# Altium schematic sheet pca20020_sheet8_power_supply.SchDoc: PCA20020 - Power Supply
size A4; DocumentNumber: 8; Revision: 1.0.0; SheetNumber: 8; SheetTotal: 9; DrawnBy: RUBR; PCBRevision: 0264RUBR; DocumentSize: A4; PCAName: PCA20020; PCBNumber: 400182
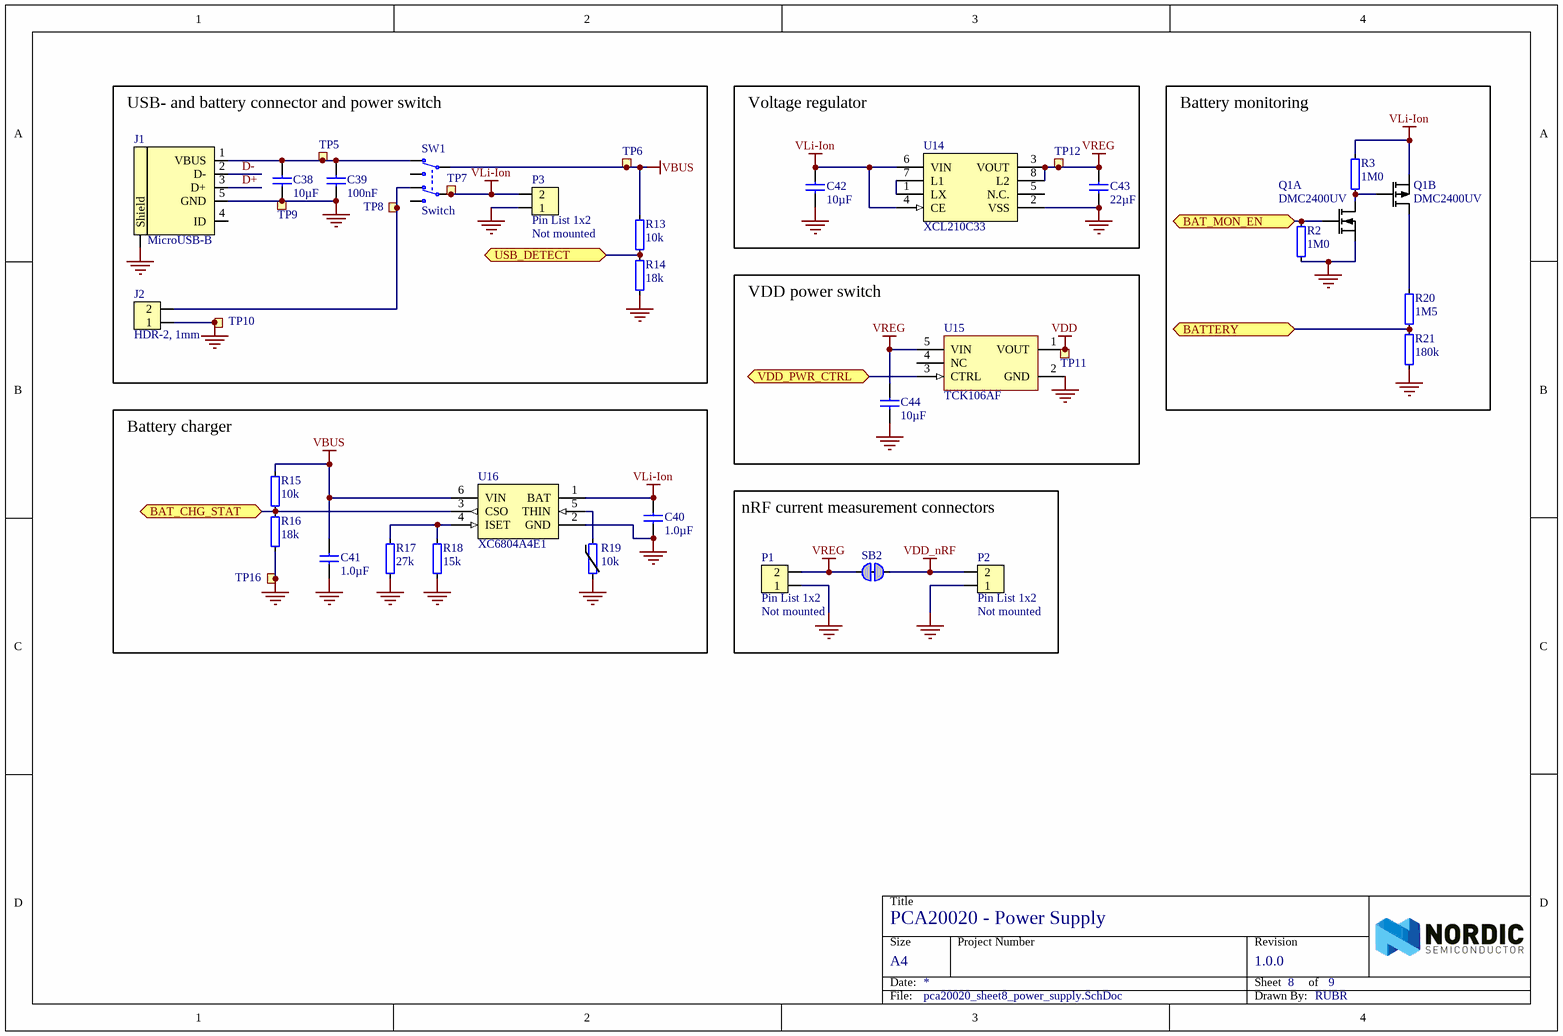
[diagram p0: pca20020_sheet8_power_supply.SchDoc]

## Parts
C38  10µF  [CAPC1608X06L]
C39  100nF  [CAPC1005X04L]
C40  1.0µF  [CAPC1608X06L]
C41  1.0µF  [CAPC1608X06L]
C42  10µF  [CAPC1608X06L]
C43  22µF  [CAPC1608X06L]
C44  10µF  [CAPC1608X06L]
J1  MicroUSB-B  [USB-Micro-B-RA-SMD-PiP]
J2  HDR-2, 1mm  [SM02B-SRSS-TB]
P1  Pin List 1x2  Assembly: Not mounted  [LIST_1x2-NC]
P2  Pin List 1x2  Assembly: Not mounted  [LIST_1x2-NC]
P3  Pin List 1x2  Assembly: Not mounted  [LIST_1x2-NC]
Q1  DMC2400UV  [SOTFL50P162X60-6N]  (parts A,B of 2)
R2  1M0  [RESC1005X04L]
R3  1M0  [RESC1005X04L]
R13  10k  [RESC1005X04L]
R14  18k  [RESC1005X04L]
R15  10k  [RESC1005X04L]
R16  18k  [RESC1005X04L]
R17  27k  [RESC1005X04L]
R18  15k  [RESC1005X04L]
R19  10k  [RESC1005X04L]
R20  1M5  [RESC1005X04L]
R21  180k  [RESC1005X04L]
SB2  Solderbridge  [Solderbridge_Shorted]  (value not drawn)  (net tie, no BOM)
SW1  Switch  [Switch-Slide-RA-J-Lead-DPDT-8.5x3.5mm]
TP5  Ø1.5mm,SMD  [TP_SMD_Ø1.5mm]  (value not drawn)  (no BOM)
TP6  Ø1.5mm,SMD  [TP_SMD_Ø1.5mm]  (value not drawn)  (no BOM)
TP7  Ø1.5mm,SMD  [TP_SMD_Ø1.5mm]  (value not drawn)  (no BOM)
TP8  Ø1.5mm,SMD  [TP_SMD_Ø1.5mm]  (value not drawn)  (no BOM)
TP9  Ø1.5mm,SMD  [TP_SMD_Ø1.5mm]  (value not drawn)  (no BOM)
TP10  Ø1.5mm,SMD  [TP_SMD_Ø1.5mm]  (value not drawn)  (no BOM)
TP11  Ø1.5mm,SMD  [TP_SMD_Ø1.5mm]  (value not drawn)  (no BOM)
TP12  Ø1.5mm,SMD  [TP_SMD_Ø1.5mm]  (value not drawn)  (no BOM)
TP16  TP  [TESTPAD-TH]  (value not drawn)  (no BOM)
U14  XCL210C33  [CL-2025]
U15  TCK106AF  [SOT95P280X140-5N]
U16  XC6804A4E1  [USP-6EL]

## Blocks framed on the sheet
USB- and battery connector and power switch: C38 C39 J1 J2 P3 R13 R14 SW1 TP5-TP10
Voltage regulator: C42 C43 TP12 U14
Battery monitoring: Q1 R2 R3 R20 R21
VDD power switch: C44 TP11 U15
Battery charger: C40 C41 R15-R19 TP16 U16
nRF current measurement connectors: P1 P2 SB2

## Ports
BAT_CHG_STAT (bidir), BAT_MON_EN (bidir), BATTERY (bidir), USB_DETECT (bidir), VDD_PWR_CTRL (bidir)

## Nets
GND: C38.2 C39.2 C40.1 C41.1 C42.1 C43.1 C44.1 J1.5(GND) J1.6(Shield) J2.1 P1.1 P2.1 P3.1 Q1.1(S1) R2.2 R14.2 R16.2 R17.2 R18.2 R19.2 R21.2 TP9.1 TP10.1 TP16.1 U14.2(VSS) U14.9(VSS) U15.2(GND) U16.2(GND) U16.7(GND)
VBUS: C41.2 R13.1 R15.1 SW1.2(COM-1) TP6.1 U16.6(VIN)
VDD: TP11.1 U15.1(VOUT)
VDD_nRF: P2.2 SB2.1
VLi-Ion: C40.2 C42.2 P3.2 Q1.4(S2) R3.1 SW1.5(COM-2) TP7.1 U14.4(CE) U14.6(VIN) U16.1(BAT)
VREG: C43.2 C44.2 P1.2 SB2.2 TP12.1 U14.3(VOUT) U14.8(L2) U15.5(VIN)
BAT_CHG_STAT: R15.2 R16.1 U16.3(CSO) ; port BAT_CHG_STAT
BAT_MON_EN: Q1.2(G1) R2.1 ; port BAT_MON_EN
BATTERY: R20.2 R21.1 ; port BATTERY
D+: J1.3(D+)
D-: J1.2(D-)
USB_DETECT: R13.2 R14.1 ; port USB_DETECT
VDD_PWR_CTRL: U15.3(CTRL) ; port VDD_PWR_CTRL
NetC38_1: C38.1 C39.1 J1.1(VBUS) SW1.3(N.C-1) TP5.1
NetJ2_2: J2.2 SW1.6(N.C-2) TP8.1
NetQ1_3: Q1.3(D2) R20.1
NetQ1_5: Q1.5(G2) Q1.6(D1) R3.2
NetR17_1: R17.1 R18.1 U16.4(ISET)
NetR19_1: R19.1 U16.5(THIN)
NetU14_1: U14.1(LX) U14.7(L1)

Not connected (* = marked no-connect by the designer): J1 4(ID); SW1 1(N.O-1) 4(N.O-2); U14 5(N.C.); U15 4(NC)

## Notes on the sheet
- Title
- Size
- Date:
- Project Number
- Sheet         of
- Revision
- File:
- Drawn By:

## Library data of the parts
C38 C42 C44 = C0603-10µ: Capacitor, X5R, ±20%; Part number IPS: 00000007785; Note: 6.3V; Artikkelnr Noca: 20039234; Artikkelnr Simpro: N.A.; Part Number: C0603-10µ; Manufacturer: *; Manufacturer Part Number: *; Datasheet: *; LatestRevisionDate: 2011-01-17; Pin Count: 2; Publisher: Nordic Semiconductor; Published: 2011-01-17; Value: 10µF; Supplier: *; Supplier part number: *; 2nd source Supplier: *; 2nd source part number: *; Footprint Doc: 0603
C39 = C0402-100n: Capacitor, X7R, ±10%; Part number IPS: 00000005296; Note: 16V; Artikkelnr Noca: 20039200; Artikkelnr Simpro: N.A.; Part Number: C0402-100n; Manufacturer: *; Manufacturer Part Number: *; Datasheet: *; LatestRevisionDate: 2009-11-23; Pin Count: 2; Publisher: Nordic Semiconductor; Published: 2009-05-08; Value: 100nF; Supplier: *; Supplier part number: *; 2nd source Supplier: *; 2nd source part number: *; Footprint Doc: 0402
C40 C41 = C0603-1µ0: Capacitor, X7R, ±10%; Part number IPS: 00000000616; Note: 16V; Artikkelnr Noca: 20039335; Artikkelnr Simpro: N.A.; Part Number: C0603-1µ0; Manufacturer: *; Manufacturer Part Number: *; Datasheet: *; Footprint Doc: 0603; LatestRevisionDate: 2013-06-05; Pin Count: 2; Publisher: Nordic Semiconductor; Published: 2009-05-08; Value: 1.0µF; Supplier: *; Supplier part number: *; 2nd source Supplier: *; 2nd source part number: *
C43 = C0603-22µ-6.3V: CAP CER 22UF 6.3V 20% X5R 0603; Manufacturer: Samsung; Manufacturer Part Number: CL10A226MQ8NRNC; Part number IPS: 00000007787; Artikkelnr Noca: N.A.; Part Number: C0603-22µ-6.3V; Datasheet: http://www.samsungsem.com/kr/front/downloadcms.do?path=/kr/support/product-search/mlcc/__icsFiles/afieldfile/2014/11/05&fileName=S_CL10A226MQ8NRNC.pdf; Footprint Doc: 0603; LatestRevisionDate: 2015-04-10; Pin Count: 2; Publisher: Nordic Semiconductor; Published: 2015-04-10; Value: 22µF; Note: 6.3V; Supplier: Digi-Key; Supplier part number: 1276-1193-1-ND; 2nd source Supplier: *; 2nd source part number: *; Artikkelnr Simpro: N.A.
J1 = USB-Micro-B-RA-SMD-PiP: MicroUSB-B-SMT; Manufacturer: Allen Creations Corp.; Manufacturer Part Number: AJU55-BS2111-L; 2nd source part number: 609-4616-1-ND; Part number IPS: 00000007790; Artikkelnr Noca: 55029020; Artikkelnr Simpro: N.A.; Part Number: USB-Micro-B-RA-SMD-PiP; Datasheet: \\hizz\pro\app9717\Datasheet\connectores\Allen Creations Corp\AJU-211.pdf; Footprint Doc: USB-Micro-B-RA-SMD-PiP; LatestRevisionDate: 2016-04-21; Pin Count: 5; Publisher: Nordic Semiconductor; Published: 2014-10-07; Value: MicroUSB-B; Note: *; Supplier: Cabcon; Supplier part number: AJU55-BS2111-L; 2nd source Supplier: Digi-Key
J2 = SM02B-SRSS-TB: 1.0mm pitch connector side entry SMD; Manufacturer: JST; Manufacturer Part Number: SM02B-SRSS-TB(LF)(SN); Part number IPS: 00000007791; Note: JST, Header; Artikkelnr Noca: 55010030; Artikkelnr Simpro: N.A.; Part Number: SM02B-SRSS-TB; Datasheet: http://www.jst-mfg.com/product/pdf/eng/eSH.pdf; Footprint Doc: SM02B-SRSS-TB; LatestRevisionDate: 2016-06-20; Pin Count: 2; Publisher: Nordic Semiconductor; Published: 2016-06-20; Value: HDR-2, 1mm; Supplier: Digi-Key; Supplier part number: 455-1802-1-ND; 2nd source Supplier: *; 2nd source part number: *
P1-P3 = Pin List 1x2, N.C.: Pin List 1x2, 2.54mm (100mil); Artikkelnr Noca: N.A.; Part Number: Pin List 1x2, N.C.; Manufacturer: *; Manufacturer Part Number: *; Datasheet: *; Footprint Doc: LIST_1x2; LatestRevisionDate: 2017-02-02; Pin Count: 2; Publisher: Nordic Semiconductor; Published: 2017-01-30; Value: Pin List 1x2; Note: *; Supplier: *; Supplier part number: *; 2nd source Supplier: *; 2nd source part number: *; Artikkelnr Simpro: N.A.
Q1 = DMC2400UV: Dual N & P Ch MOFET, 1.03A/0.7A, 480mOhm, 450mW; Manufacturer: Diodes Incorporated; Part number IPS: 00000007803; Note: Dual N & P Channel Digital FET; Artikkelnr Noca: N.A.; Part Number: DMC2400UV; Manufacturer Part Number: DMC2400UV; Datasheet: http://www.diodes.com/_files/datasheets/DMC2400UV.pdf; Footprint Doc: SOT-563; LatestRevisionDate: 2016-01-18; Pin Count: 6; Publisher: Nordic Semiconductor; Published: 2016-01-18; Value: DMC2400UV; Supplier: Digi-Key; Supplier part number: DMC2400UV-7DICT-ND; 2nd source Supplier: *; 2nd source part number: *; Artikkelnr Simpro: N.A.
R2 R3 = R0402-1M0: Resistor, ±1%, 0.063W; Part number IPS: 00000006807; Note: Chip Res 1%; Artikkelnr Noca: 27049145; Artikkelnr Simpro: N.A.; Value Ohm: 1000000; Part Number: R0402-1M0; Manufacturer: *; Manufacturer Part Number: *; Datasheet: *; LatestRevisionDate: 2009-11-23; Pin Count: 2; Publisher: Nordic Semiconductor; Published: 2009-05-08; Value: 1M0; Supplier: *; Supplier part number: *; 2nd source Supplier: *; 2nd source part number: *; Footprint Doc: 0402
R13 R15 = R0402-10k: Resistor, ±1%, 0.063W; Part number IPS: 00000002093; Note: Chip Res 1%; Artikkelnr Noca: 27049097; Artikkelnr Simpro: N.A.; Value Ohm: 10000; Part Number: R0402-10k; Manufacturer: *; Manufacturer Part Number: *; Datasheet: *; LatestRevisionDate: 2009-11-23; Pin Count: 2; Publisher: Nordic Semiconductor; Published: 2009-05-08; Value: 10k; Supplier: Farnell; Supplier part number: 173-8864; 2nd source Supplier: *; 2nd source part number: *; Footprint Doc: 0402
R14 R16 = R0402-18k: Resistor, ±1%, 0.063W; Part number IPS: 00000003300; Note: Chip Res 1%; Artikkelnr Noca: 27049103; Artikkelnr Simpro: N.A.; Value Ohm: 18000; Part Number: R0402-18k; Manufacturer: *; Manufacturer Part Number: *; Datasheet: *; LatestRevisionDate: 2009-11-23; Pin Count: 2; Publisher: Nordic Semiconductor; Published: 2009-05-08; Value: 18k; Supplier: Farnell; Supplier part number: 173-8867; 2nd source Supplier: *; 2nd source part number: *; Footprint Doc: 0402
R17 = R0402-27k: Resistor, ±1%, 0.063W; Part number IPS: 00000004188; Note: Chip Res 1%; Artikkelnr Noca: 27049107; Artikkelnr Simpro: N.A.; Value Ohm: 27000; Part Number: R0402-27k; Manufacturer: *; Manufacturer Part Number: *; Datasheet: *; LatestRevisionDate: 2009-11-23; Pin Count: 2; Publisher: Nordic Semiconductor; Published: 2009-05-08; Value: 27k; Supplier: Farnell; Supplier part number: 173-8869; 2nd source Supplier: *; 2nd source part number: *; Footprint Doc: 0402
R18 = R0402-15k: Resistor, ±1%, 0.063W; Part number IPS: 00000002098; Note: Chip Res 1%; Artikkelnr Noca: 27049101; Artikkelnr Simpro: N.A.; Value Ohm: 15000; Part Number: R0402-15k; Manufacturer: *; Manufacturer Part Number: *; Datasheet: *; LatestRevisionDate: 2009-11-23; Pin Count: 2; Publisher: Nordic Semiconductor; Published: 2009-05-08; Value: 15k; Supplier: Farnell; Supplier part number: 173-8866; 2nd source Supplier: *; 2nd source part number: *; Footprint Doc: 0402
R19 = NCP15XH103F03RC: THERMISTOR 10K OHM NTC 0402 SMD; Manufacturer: Murata; 2nd source part number: 2456121; Part number IPS: 00000007808; Note: Chip Res 1%; Artikkelnr Noca: N.A.; Value Ohm: 10000; Part Number: NCP15XH103F03RC; Manufacturer Part Number: NCP15XH103F03RC; Datasheet: *; LatestRevisionDate: 2015-03-25; Pin Count: 2; Publisher: Nordic Semiconductor; Published: 2015-03-25; Value: 10k; Supplier: Digi-Key; Supplier part number: 490-4801-1-ND; 2nd source Supplier: Farnell; Footprint Doc: 0402; Artikkelnr Simpro: N.A.
R20 = R0402-1M5: Resistor, ±1%, 0.063W; Part number IPS: 00000007809; Note: Chip Res 1%; Artikkelnr Noca: 27049149; Artikkelnr Simpro: N.A.; Value Ohm: 1500000; Part Number: R0402-1M5; Manufacturer: *; Manufacturer Part Number: *; Datasheet: *; LatestRevisionDate: 2009-11-23; Pin Count: 2; Publisher: Nordic Semiconductor; Published: 2009-05-08; Value: 1M5; Supplier: *; Supplier part number: *; 2nd source Supplier: *; 2nd source part number: *; Footprint Doc: 0402
R21 = R0402-180k: Resistor, ±1%, 0.063W; Part number IPS: 00000007810; Note: Chip Res 1%; Artikkelnr Noca: 27049127; Artikkelnr Simpro: N.A.; Value Ohm: 180000; Part Number: R0402-180k; Manufacturer: *; Manufacturer Part Number: *; Datasheet: *; LatestRevisionDate: 2009-11-23; Pin Count: 2; Publisher: Nordic Semiconductor; Published: 2009-05-08; Value: 180k; Supplier: *; Supplier part number: *; 2nd source Supplier: *; 2nd source part number: *; Footprint Doc: 0402
SB2 = Solderbridge Shorted: Shorted Solderbridge; Artikkelnr Noca: N.A.; Part Number: Solderbridge Shorted; Manufacturer: *; Manufacturer Part Number: *; Datasheet: *; Footprint Doc: Solderbridge_Shorted; LatestRevisionDate: 2012-08-07; Pin Count: 2; Publisher: Nordic Semiconductor; Published: 2012-08-07; Value: Solderbridge; Note: *; Supplier: *; Supplier part number: *; 2nd source Supplier: *; 2nd source part number: *; Artikkelnr Simpro: N.A.
SW1 = Switch-Slide-RA-J-Lead-DPDT-8.5x3.5mm_C&K: SMD slide Switch (ON-ON); Manufacturer: C&K Components; Manufacturer Part Number: JS202011JAQN; 2nd source part number: 611-JS202011JAQN; Part number IPS: 00000007811; Artikkelnr Noca: N.A.; Part Number: Switch-Slide-RA-J-Lead-DPDT-8.5x3.5mm_C&K; Datasheet: http://www.ck-components.com/media/1422/js.pdf; Footprint Doc: Switch-Slide-RA-J-Lead-DPDT-8.5x3.5mm; LatestRevisionDate: 2017-02-01; Pin Count: 6; Publisher: Nordic Semiconductor; Published: 2016-09-15; Value: Switch; Note: *; Supplier: Digi-Key; Supplier part number: CKN10722CT-ND; 2nd source Supplier: Mouser; Artikkelnr Simpro: N.A.
TP5-TP12 = TP_SMD_Ø1.5MM: 1.0mm circular SMD testpad; Manufacturer: Nordic Semiconductor; Artikkelnr Noca: N.A.; Part Number: TP_SMD_Ø1.5MM; Manufacturer Part Number: *; Datasheet: *; Footprint Doc: TP_SMD_Ø1.5mm; LatestRevisionDate: 2016-06-02; Pin Count: 1; Publisher: Nordic Semiconductor; Published: 2016-06-02; Value: Ø1.5mm,SMD; Note: *; Supplier: *; Supplier part number: *; 2nd source Supplier: *; 2nd source part number: *; Artikkelnr Simpro: N.A.
TP16 = Testpoint TH: Testpoint, through hole; Artikkelnr Noca: N.A.; Part Number: Testpoint TH; Manufacturer: *; Manufacturer Part Number: *; Datasheet: *; Footprint Doc: TESTPAD-TH; LatestRevisionDate: 2009-12-12; Pin Count: 1; Publisher: Nordic Semiconductor; Published: 2009-12-12; Value: TP; Note: *; Supplier: *; Supplier part number: *; 2nd source Supplier: *; 2nd source part number: *; Artikkelnr Simpro: N.A.
U14 = XCL210C33: 3.3V 200mA Inductor Built-in Step-Down “micro DC/DC” Converter; Manufacturer: Torex Semiconductor; Part number IPS: 00000007826; Artikkelnr Noca: N.A.; Part Number: XCL210C33; Manufacturer Part Number: XCL210C33; Datasheet: https://www.torexsemi.com/file/xcl210/XCL210.pdf; Footprint Doc: CL-2025; LatestRevisionDate: 2017-01-30; Pin Count: 8; Publisher: Nordic Semiconductor; Published: 2016-09-29; Value: XCL210C33; Note: *; Supplier: *; Supplier part number: *; 2nd source Supplier: *; 2nd source part number: *; Artikkelnr Simpro: N.A.
U15 = TCK106AF,LF: 1.0 A Load Switch IC with Slew Rate Control Driver in Small Package; Manufacturer: Toshiba; Part number IPS: 00000007823; Artikkelnr Noca: 15070086; Artikkelnr Simpro: N.A.; Part Number: TCK106AF,LF; Manufacturer Part Number: TCK106AF,LF; Datasheet: https://toshiba.semicon-storage.com/info/docget.jsp?did=53240&prodName=TCK108AF; Footprint Doc: SOT-25; LatestRevisionDate: 2016-09-29; Pin Count: 5; Publisher: Nordic Semiconductor; Published: 2016-09-29; Value: TCK106AF; Note: *; Supplier: Digi-Key; Supplier part number: TCK106AFLFCT-ND; 2nd source Supplier: *; 2nd source part number: *
U16 = XC6804A4E14R-G: One Cell Li-ion/Li-polymer Linear Charger IC with Battery Temperature Detection; Manufacturer: Torex Semiconductor; 2nd source part number: 865-XC6804A4E14R-G; Part number IPS: 00000007825; Artikkelnr Noca: N.A.; Part Number: XC6804A4E14R-G; Manufacturer Part Number: XC6804A4E14R-G; Datasheet: https://www.torexsemi.com/file/xc6804/XC6804.pdf; Footprint Doc: USP-6EL; LatestRevisionDate: 2016-09-29; Pin Count: 6; Publisher: Nordic Semiconductor; Published: 2016-09-29; Value: XC6804A4E1; Note: *; Supplier: Digi-Key; Supplier part number: 893-1312-1-ND; 2nd source Supplier: Mouser; Artikkelnr Simpro: N.A.